# Altium schematic sheet Top.SchDoc
size A4; SheetNumber: 2; SheetTotal: 2
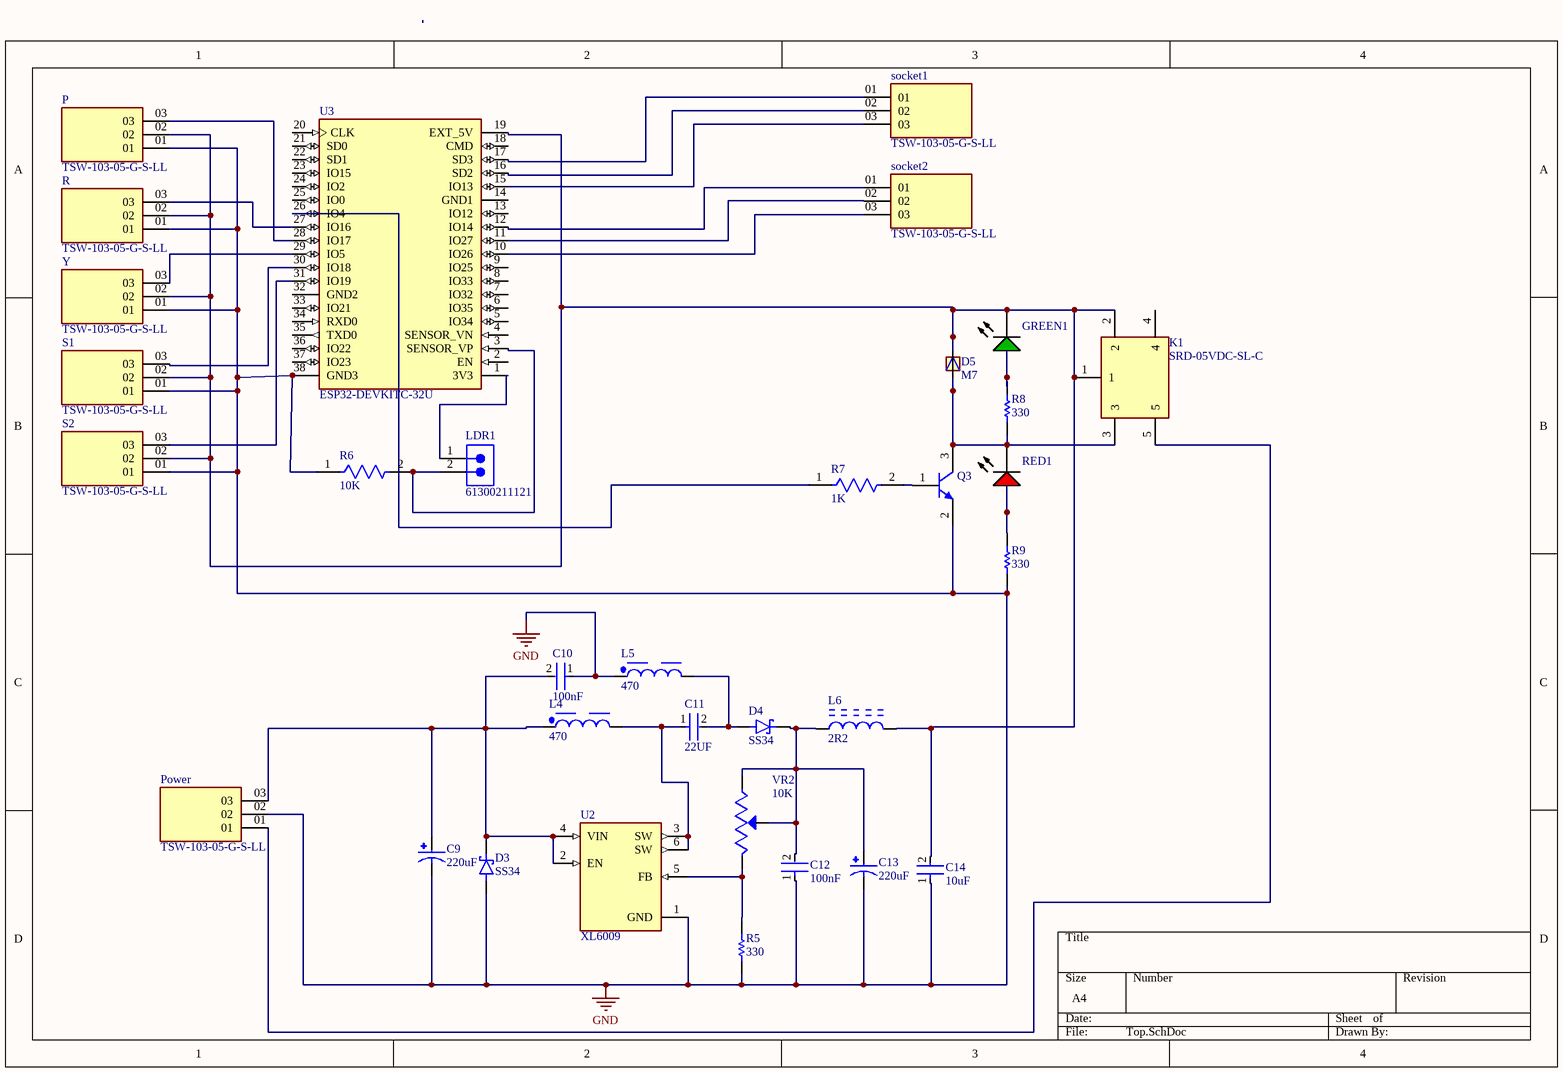
[diagram p0: Top.SchDoc]

## Parts
C9  220uF  [CAP_EEETC1V221UV]
C10  100nF  [FP-CGA3E-0_3-0_1-MFG]
C11  22UF  [FP-1206-L_3_2_0_2-W_1_6_0-IPC_C]
C12  100nF  [FP-CGA3E-0_3-0_1-MFG]
C13  220uF  [CAP_EEETC1V221UV]
C14  10uF  [FP-1206-L_3_2_0_2-W_1_6_0-IPC_C]
D3  SS34  [DIO_SS34]
D4  SS34  [DIO_SS34]
D5  M7  [DIOM505270X240]
GREEN1  (no value)  [KING-WP7113SGD_V]
K1  SRD-05VDC-SL-C  [SRD]
L4  470  [WE-PD_1280]
L5  470  [WE-PD_1280]
L6  2R2  [BOUR-SRN6045_V]
LDR1  61300211121  [61300211121]
P  TSW-103-05-G-S-LL  [SAMTEC_TSW-103-05-G-S-LL]
Power  TSW-103-05-G-S-LL  [SAMTEC_TSW-103-05-G-S-LL]
Q3  (no value)  [FAIR-SOT23-3_V]
R  TSW-103-05-G-S-LL  [SAMTEC_TSW-103-05-G-S-LL]
R5  330  [RESC1608X55X30LL15T15]
R6  10K  [FP-RC0603-0_55-IPC_C]
R7  1K  [FP-ERA3A-MFG]
R8  330  [RESC1608X55X30LL15T15]
R9  330  [RESC1608X55X30LL15T15]
RED1  (no value)  [KING-WP7113SRDD_V]
S1  TSW-103-05-G-S-LL  [SAMTEC_TSW-103-05-G-S-LL]
S2  TSW-103-05-G-S-LL  [SAMTEC_TSW-103-05-G-S-LL]
socket1  TSW-103-05-G-S-LL  [SAMTEC_TSW-103-05-G-S-LL]
socket2  TSW-103-05-G-S-LL  [SAMTEC_TSW-103-05-G-S-LL]
U2  XL6009  [DPAK170P1435X465-6N]
U3  ESP32-DEVKITC-32U  [MODULE_ESP32-DEVKITC-32U]
VR2  10K  [TRIM_3296W1103LF]
Y  TSW-103-05-G-S-LL  [SAMTEC_TSW-103-05-G-S-LL]

## Nets
GND: C9.2 C10.1 C12.1 C13.2 C14.1 D3.A L5.1 P.01 Power.02 Q3.2(E) R.01 R5.1 R6.1 R9.1 S1.01 S2.01 U2.1(GND) U3.38(GND3) Y.01
NetC9_1: C9.1 C10.2 D3.C(K) L4.1 Power.03 U2.2(EN) U2.4(VIN)
NetC11_1: C11.1 L4.2 U2.3(SW) U2.6(SW)
NetC11_2: C11.2 D4.A L5.2
NetC12_2: C12.2 C13.1 D4.C(K) L6.1 VR2.1(CCW) VR2.2(WIPER)
NetC14_2: C14.2 D5.C GREEN1.2(K) K1.1 K1.2 L6.2 P.02 R.02 S1.02 S2.02 U3.19(EXT_5V) Y.02
NetD5_A: D5.A K1.3 Q3.3(C) R8.1 RED1.2(K)
NetGREEN1_1: GREEN1.1(A) R8.2
NetK1_5: K1.5 Power.01
NetLDR1_1: LDR1.1 U3.1(3V3)
NetLDR1_2: LDR1.2 R6.2 U3.3(SENSOR_VP)
NetP_03: P.03 U3.28(IO17)
NetQ3_1: Q3.1(B) R7.2
NetR5_2: R5.2 U2.5(FB) VR2.3(CW)
NetR7_1: R7.1 U3.26(IO4)
NetR9_2: R9.2 RED1.1(A)
NetR_03: R.03 U3.27(IO16)
NetS1_03: S1.03 U3.30(IO18)
NetS2_03: S2.03 U3.31(IO19)
Netsocket1_01: socket1.01 U3.17(SD3)
Netsocket1_02: socket1.02 U3.16(SD2)
Netsocket1_03: socket1.03 U3.15(IO13)
Netsocket2_01: socket2.01 U3.12(IO14)
Netsocket2_02: socket2.02 U3.11(IO27)
Netsocket2_03: socket2.03 U3.10(IO26)
NetU3_29: U3.29(IO5) Y.03

Not connected (* = marked no-connect by the designer): K1 4; U3 2(EN) 4(SENSOR_VN) 5(IO34) 6(IO35) 7(IO32) 8(IO33) 9(IO25) 13(IO12) 14(GND1) 18(CMD) 20(CLK) 21(SD0) 22(SD1) 23(IO15) 24(IO2) 25(IO0) 32(GND2) 33(IO21) 34(RXD0) 35(TXD0) 36(IO22) 37(IO23)

## Library data of the parts
C9 C13 = EEETC1V221UV: CAP ALUM 220UF 20% 35V SMD; MF: Panasonic Electronic Components; MP: EEE-TC1V221UV; Check_prices: https://www.snapeda.com/parts/EEE-TC1V221UV/Panasonic/view-part/6178608/?ref=eda; Package: RADIAL-2 Panasonic; Value: *; Price: None; Availability: In Stock; SnapEDA_Link: https://www.snapeda.com/parts/EEE-TC1V221UV/Panasonic/view-part/6178608/?ref=snap; Purchase-URL: https://pricing.snapeda.com/search/part/EEE-TC1V221UV/?ref=eda
C10 C12 = CMP-2000-07546-2: Cap Ceramic 100nF 50V X7R 10% Pad SMD 0603 +125°C Automotive T/R; Weight: 7.1E-05oz; Composition: Ceramic; Max Operating Temperature: 125°C; Termination: SMD/SMT; Dielectric: X7R; Length: 1.6mm; Package Quantity: 1; REACH SVHC: No SVHC; Lead Free: Lead Free; Case Code (Metric): 1608; Min Operating Temperature: -55°C; Packaging: Tape and Reel; Tolerance: 10%; Voltage Rating: 50V; Case Code (Imperial): 0603; Capacitance: 100nF; Case/Package: 0603; Voltage Rating (DC): 50V; Depth: 0.8mm; Radiation Hardening: No; Ratings: AEC-Q200; Mount: Surface Mount; Voltage: 50V; Thickness: 0.035inch; Width: 0.8mm; Height: 0.8mm
C11 = CMP-1037-04985-3: CAP CER 22UF 6.3V X7R 1206; Tolerance: 10%; Dissipation Factor: 5%; Thickness: 0.07inch; Min Operating Temperature: -55°C; Width: 1.6mm; Case Code (Metric): 3216; Construction: Flat; Max Operating Temperature: 125°C; Case/Package: 1206; Case Code (Imperial): 1206; Lead Free: Lead Free; Capacitance: 22uF; REACH SVHC: No SVHC; Voltage Rating (DC): 6.3V; Number of Pins: 2; Contact Plating: Tin; Dielectric: X7R; Radiation Hardening: No; Depth: 1.6mm; Series: FlEXITERM; Mount: Surface Mount; Voltage Rating: 6.3V; Package Quantity: 2500; RoHS Compliant: Yes; Length: 3.2mm; Height: 1.78mm; Voltage: 6.3V; Termination: SMD/SMT; Packaging: Tape and Reel
C14 = CMP-04427-020964-1: General Purpose Ceramic Capacitor, 1206, 10uF, 10%, X5R, 15%, 6.3V; Insulation Resistance: 100GR; Dissipation Factor: 5%; Voltage Rating (DC): 6.3V; Tolerance: 10%; Number of Pins: 2; REACH SVHC: No SVHC; Series: -; Case/Package: 1206; Length: 3.2mm; Dielectric: X5R; Lead Free: Lead Free; Package Quantity: 1; Case Code (Imperial): 1206; Width: 1.6mm; Thickness: 0.07inch; Case Code (Metric): 3216; Depth: 1.6mm; Max Operating Temperature: 85°C; Size: 1.78mm; Radiation Hardening: No; Min Operating Temperature: -55°C; Packaging: Tape and Reel; Capacitance: 10uF; Weight: 0.000571oz; Height: 0.07mm; Voltage: 6.3V; Construction: Flat; RoHS Compliant: Yes; Mount: Surface Mount; Termination: SMD/SMT; Voltage Rating: 6.3V
D3 D4 = CMP-004-00031-2: 3A, 40V, Schottky Rectifier; MF: Taiwan Semiconductor; Pins: 2; Source: SS34.SchLib; MP: SS34; SnapEDA_Link: https://www.snapeda.com/parts/SS34/Taiwan+Semiconductor/view-part/?ref=snap; Check_prices: https://www.snapeda.com/parts/SS34/Taiwan+Semiconductor/view-part/?ref=eda; Component Type: Standard; Case/Package: DO-214AB-2 Taiwan Semiconductor; Value: *; Design Item ID: SS34
D5 = M7: Diode, SMA, 1000V, 1A, 150°C; MF: Diotec Semiconductor; SnapEDA_Link: https://www.snapeda.com/parts/M7/Diotec/view-part/?ref=snap; Package: DO-214AC Diotec; Value: *; MP: M7; Check_prices: https://www.snapeda.com/parts/M7/Diotec/view-part/?ref=eda
GREEN1 = CMP-007-00010-2: LED Green, 62.5 mW, 25 mA, -40 to 85 degC, 2-Pin THD, RoHS, Bulk; Manufacturer: Kingbright; Lens Style: Dome; Nominal Vf: 2.2V; Power: 62.5mW; Luminous Intensity: 40mcd; Viewing Angle: 30degrees; Datasheet URL: http://www.kingbrightusa.com/images/catalog/SPEC/WP7113SGD.pdf; Datasheet Version: Rev. 6B, 01/2015; Illumination Colour: Green; Package Quantity: 1000; Package Description: 2-Pin Through Hole Device, Dia 5.9 mm, Body Length 8.6 mm; Colour: Green; Case/Package: Radial; RoHS Compliant: True; Package Reference: WP7113SGD; Mounting Technology: TH; Packaging: Bulk; Forward Voltage: 2.2V
K1 = SRD-05VDC-SL-C: Relay or Contactor; Manufacturer_Name: Songle Relay; Datasheet Link: http://files.microjpm.webnode.com/200001010-dda41de9e1/Songle%20Relay%20Datasheet.pdf; Manufacturer_Part_Number: SRD-05VDC-SL-C
L4 L5 = CMP-0227-00205-2: NexarPartId: 8917149; Resistance: 100mΩ; Shielding: Shielded; Saturation Current: 3A; Inductance: 47µH; Self Resonant Frequency: 7.9MHz; Tolerance: 20%; DC Resistance (DCR): 53mΩ; Test Frequency: 1kHz; Max DC Current: 2.7A; Core Material: Ferrite; Depth: 12mm; Ambient Temperature Range High: 85°C; Height - Seated (Max): 8.001mm; Max Operating Temperature: 125°C; Weight: 4.535924g; Series Resistance: 100mΩ; RoHS: Compliant; Mount: Surface Mount; Case/Package: Nonstandard; Width: 12mm; Ambient Temperature Range Low: -40°C; Current Rating: 3A; Height: 8mm; Packaging: Cut Tape (CT); Length: 12mm; Number of Pins: 2; Termination: SMD/SMT; Lead Pitch: 7mm; Lead Free: Lead Free; Inductance Tolerance: 20%; Min Operating Temperature: -40°C; REACH SVHC: Unknown; RMS Current (Irms): 2.7A; Composition: Wirewound
L6 = CMP-2000-07142-1: Semi-Shielded Power Inductor, 2.2 uH, +/- 30%, 3.5 A, -40 to 125 degC, 2-Pin SMD, RoHS, Tape and Reel; Manufacturer: Bourns; Kits: SRN-LAB1-ND / -INDUCTORKIT; Other Names: SRN6045-2R2YCT; EDA / CAD Models: DownloadfromAcceleratedDesigns; Current Rating: 3.5A; 3D Model: SRN6045.stp; Q @ Freq: 15@7.96MHz; Frequency - Self Resonant: 35MHz; PCN Assembly/Origin: MagneticproductsOct/2013; Type: Wirewound; DC Resistance (DCR): 25.1mOhmMax; Product Training Modules: SRNSeries:Semi-ShieldedInductors; Frequency - Test: 100kHz; Inductance: 2.2µH; Online Catalog: SRNSeries; Material - Core: Ferrite; Current - Saturation: 6A; Size / Dimension: 0.236"Lx0.236"W(6.00mmx6.00mm); Operating Temperature: -40°C~125°C; Height - Seated (Max): 0.177"(4.50mm); Mounting Technology: SurfaceMount; Package Description: 2-Pin Surface Mounted Device, Body 6 x 6 mm; Series: SRN6045; Packaging: CutTape(CT); Mounting Type: SurfaceMount; Shielding: Shielded; Datasheet Version: 12/2014; Category: Inductors,Coils,Chokes; Datasheet URL: http://www.bourns.com/docs/Product-Datasheets/SRN6045.pdf; Standard Package: 1; Manufacturer URL: http://www.bourns.com/; Package Reference: SRN6045; RoHS Information: SRN6045SeriesMaterialDeclaration; Family: FixedInductors; Package / Case: Nonstandard; Tolerance: ±30%
LDR1 = CMP-1712-00002-6: NexarPartId: 20081794; Number of Contacts: 2; Pitch: 2.54mm; Connector Type: Male Pin; Voltage Rating: 250V; Current Rating: 3A; Gender: Male; Contact Resistance: 20mΩ; Height: 8.94mm; Lead Free: Lead Free; Number of Pins: 2; Termination: Through Hole; RoHS: Compliant; Lead Pitch: 2.54mm; REACH SVHC: No SVHC; Housing Material: PBT; Contact Mating Length: 5.9944mm; Min Operating Temperature: -40°C; Orientation: Vertical; Contact Material: Copper; Contact Gender: Male; Max Operating Temperature: 125°C; Number of Rows: 1; Number of Positions: 2; Packaging: Bulk; Contact Plating: Gold; Mount: Through Hole; Color: Black; Operating Supply Voltage: 250V
Q3 = CMP-1670-00008-1: NPN General Purpose Amplifier, 40 V, 0.2 A, -55 to 150 degC, 3-Pin SOT23, RoHS, Tape and Reel; Tolerance: 30ppm; Capacitance: 1.8E-11 f; Frequency: 12.288 MHz; ESR: 40 Ohm; Load Capacitance: 18 pF; REACH SVHC: No SVHC; Pins: 4; ComponentLink3URL: http://www.fairchildsemi.com/dwg/MA/MA03D.pdf; PackageDescription: 3-Pin Small Outline Transistor, Body 2.92 x 1.325 mm, Pitch 0.95 mm; ComponentLink1URL: https://www.fairchildsemi.com/; Max Operating Temperature: 70degC; PackageReference: SOT23-3; ComponentLink1Description: Manufacturer URL; Width: 0.126 inch; Min Operating Temperature: -20degC; DatasheetVersion: Rev. 1.1.0, 10/2014; Mount: Surface Mount; Height: 0.041 inch; Package Quantity: 1000; Frequency Tolerance: 30ppm; Packaging: Tape and Reel; ComponentLink2URL: https://www.fairchildsemi.com/datasheets/MM/MMBT3904.pdf; RoHSCompliant: True; ComponentLink3Description: Package Specification; ComponentLink2Description: Datasheet; Length: 0.197 inch
R5 R8 R9 = CMP-2000-00435-2: Chip Resistor, 330 Ohm, +/- 1%, 0.1 W, -55 to 155 degC, 0603 (1608 Metric), RoHS, Tape and Reel; Gender: Male; Mating Cycles: 10000; Current Rating: 500 mA; Voltage Rating: 10 V; REACH SVHC: No SVHC; PackageDescription: 2-Pin Surface Mount Device, Body 1.6 x 0.85 mm; Contact Finish: Gold; Pins: 8; ComponentLink1Description: Manufacturer URL; Packaging: Tape and Reel; Max Operating Temperature: 85 degC; Contact Material: Copper; Height: 1.45 mm; Width: 1.45 mm; DatasheetVersion: Apr-15; Package Quantity: 1500; Contact Plating: Gold; PackageReference: 0603; Mount: Surface Mount; Lead Pitch: 1.1 mm; Min Operating Temperature: -25 degC; ComponentLink1URL: http://www.panasonic.com/; ComponentLink2URL: http://industrial.panasonic.com/cdbs/www-data/pdf/RDA0000/AOA0000C86.pdf; Length: 13.7 mm; ComponentLink2Description: Datasheet; RoHSCompliant: true
R6 = CMP-2100-03664-2: RES 10K OHM 1% 1/10W 0603; Voltage Rating: 75V; Voltage Rating (DC): 50V; Resistance: 10kR; Power Rating: 100mW; Temperature Coefficient: 100ppm/°C; Depth: 0.8mm; Termination: SMD/SMT; Resistor Type: Thick Film; Series: RC; Construction: Rectangular; Features: Moisture Resistant; Packaging: Tape and Reel; Min Operating Temperature: -55°C; Number of Terminations: 2; Lead Pitch: 0.3mm; RoHS Compliant: Yes; Case/Package: 0603; Resistance Tolerance: 1%; Military Standard: Not; Weight: 7.1E-05oz; Number of Pins: 2; Tolerance: 1%; Length: 1.6mm; Case Code (Imperial): 0603; Lead Free: Lead Free; Width: 0.8mm; Max Power Dissipation: 100mW; Height: 0.45mm; Max Operating Temperature: 155°C; Case Code (Metric): 1608; Size Code: 0603
R7 = CMP-2000-00873-2: RES SMD 1K OHM 0.1% 1/10W 0603; Temperature Coefficient: 25ppm/°C; Voltage Rating: 75V; Max Power Dissipation: 100mW; Resistance: 1kR; Technology: METAL FILM; Number of Pins: 2; Packaging: Tape and Reel; Case Code (Imperial): 0603; Case Code (Metric): 1608; Min Operating Temperature: -55°C; REACH SVHC: No SVHC; Length: 1.6mm; Termination: SMD/SMT; Depth: 0.8mm; Resistance Tolerance: 0.1%; Number of Terminations: 2; Width: 0.8mm; Military Standard: Not; Tolerance: 0.1%; Package Quantity: 5000; Contact Plating: Tin; Height: 0.45mm; Construction: Rectangular; Case/Package: 0603; Max Operating Temperature: 155°C; Resistor Type: Thin Film; Series: ERA-3A; Size Code: 0603; RoHS Compliant: Yes; Mount: Surface Mount; Radiation Hardening: No; Power Rating: 100mW
RED1 = CMP-007-00033-2: The Super Bright Red Source Color Device, 1.85 V, -40 to 85 degC, 2-Pin THD, RoHS, Tape and Reel; Manufacturer: Kingbright; Nominal Vf: 1.85V; Luminous Intensity: 300mcd; Viewing Angle: 30degrees; Lens Style: Diffused; RoHS Compliant: True; Datasheet Version: Rev. 6A, 07/2016; Illumination Colour: Red; Case/Package: Radial; Package Reference: WP7113SRDD; Package Quantity: 500; Datasheet URL: http://www.kingbrightusa.com/images/catalog/SPEC/WP7113SRD-D.pdf; Colour: Red; Packaging: Bulk; Forward Voltage: 1.85V; Mounting Technology: TH; Package Description: 2-Pin Through Hole Device, Dia 5.9 mm, Body Length 8.6 mm
U2 = CMP-003-000000-1: The XL6009 regulator is a wide input range, current mode, DC/DC converter which is capable of generating either positive or negative output voltages.; MF: XLSEMI; Pin Count: 6; Component Type: Standard; Check_prices: https://www.snapeda.com/parts/XL6009/XLSEMI/view-part/?ref=eda; MP: XL6009; Availability: Not in stock; Source: XL6009.SchLib; Design Item ID: XL6009; Price: None; Value: *; Package: TO-263-5L XLSEMI; SnapEDA_Link: https://www.snapeda.com/parts/XL6009/XLSEMI/view-part/?ref=snap
U3 = ESP32-DEVKITC-32U: ESP32-WROOM-32UE series Transceiver; 802.11 b/g/n (Wi-Fi, WiFi, WLAN), Bluetooth® Smart Ready 4.x Dual Mode Evaluation Board; MF: Espressif Systems; SnapEDA_Link: https://www.snapeda.com/parts/ESP32-DEVKITC-32U/Espressif+Systems/view-part/?ref=snap; Package: CUSTOM-38 ESPRESSIF; Value: *; MP: ESP32-DEVKITC-32U; Check_prices: https://www.snapeda.com/parts/ESP32-DEVKITC-32U/Espressif+Systems/view-part/?ref=eda
VR2 = 3296W1103LF: Trimmer, Potentiometer 10kohm 25turn Thd; MF: Bourns; Package: None; MP: 3296W1103LF; Check_prices: https://www.snapeda.com/parts/3296W1103LF/Bourns/view-part/2487625/?ref=eda; Availability: Unavailable; Price: None; Value: *; SnapEDA_Link: https://www.snapeda.com/parts/3296W1103LF/Bourns/view-part/2487625/?ref=snap
P Power R S1 S2 socket1 socket2 Y = TSW-103-05-G-S-LL: Package: None; Price: None; Value: *; MP: TSW-103-05-G-S-LL; Availability: Unavailable